# Altium schematic sheet PMIC_USB.SchDoc
size A4; SheetNumber: 2; SheetTotal: 3
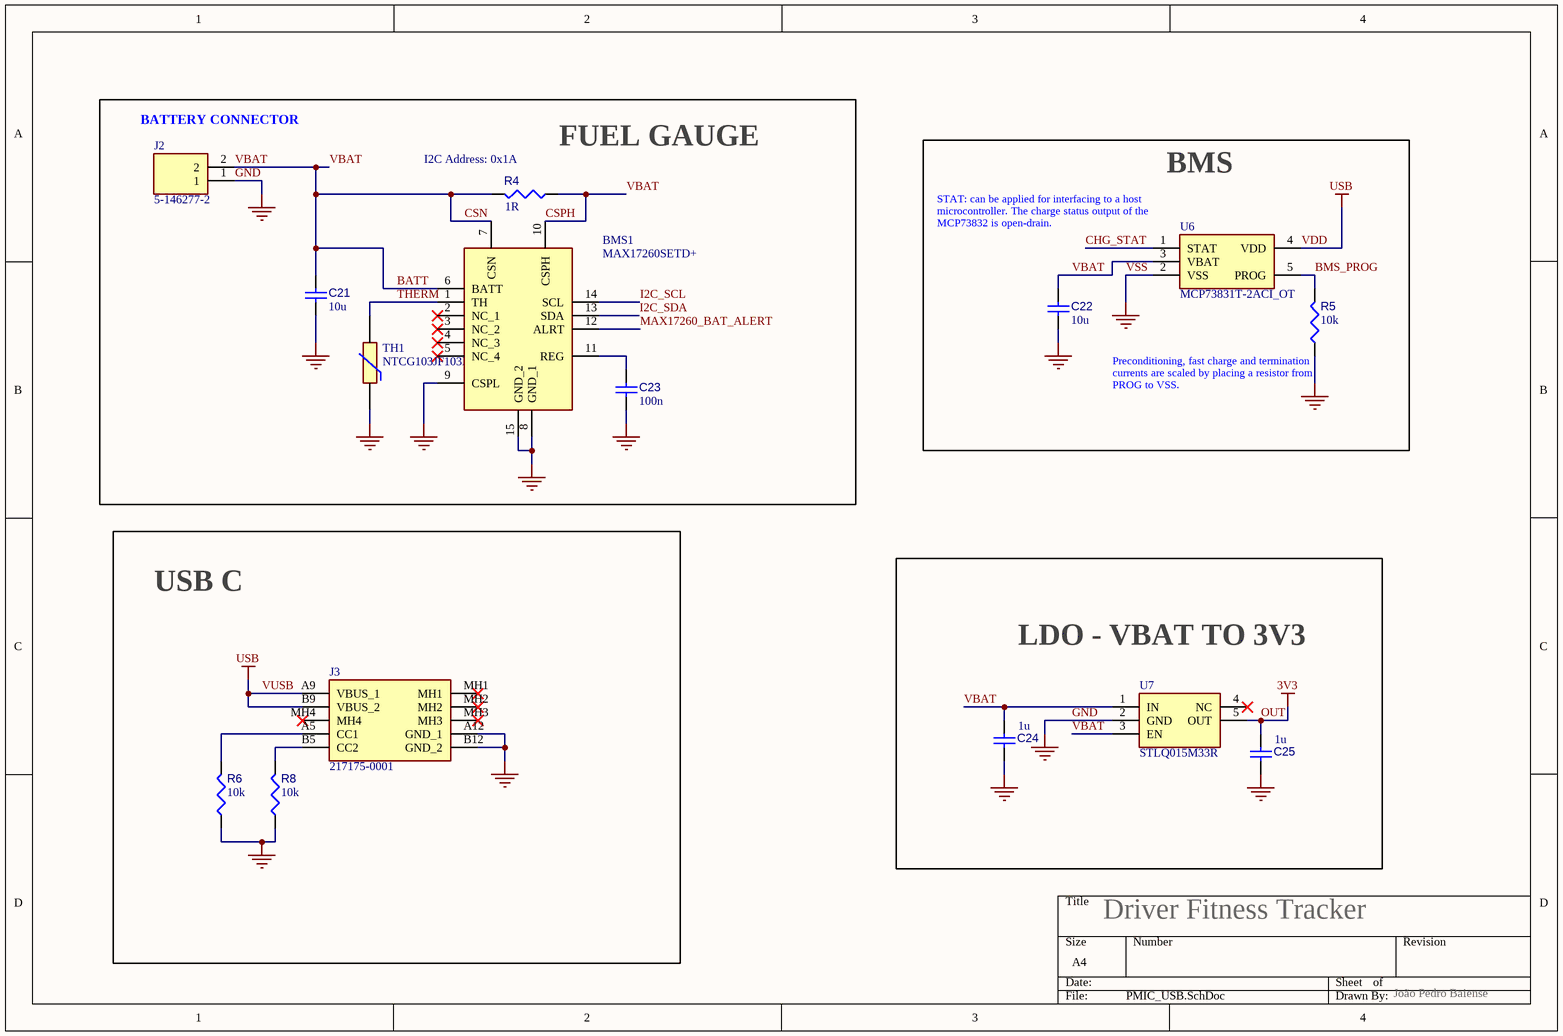
[diagram p0: PMIC_USB.SchDoc]

## Parts
BMS1  MAX17260SETD+  [SON40P300X300X80-15N]
C21  10u  [CAPC1608X90X40NL10T20]
C22  10u  [CAPC1608X90X40NL10T20]
C23  100n  [CAPC1608X90X40NL10T20]
C24  1u  [CAPC1608X90X40NL10T20]
C25  1u  [CAPC1608X90X40NL10T20]
J2  5-146277-2  [HEADER_2PINS]
J3  217175-0001  [USB_C_CONNECTOR]
R4  1R  [RESC0402(1005)_L]
R5  10k  [RESC0402(1005)_L]
R6  10k  [RESC0402(1005)_L]
R8  10k  [RESC0402(1005)_L]
TH1  NTCG103JF103FT1  [THRMC1005X55N]
U6  MCP73831T-2ACI_OT  [SOT95P270X145-5N]
U7  STLQ015M33R  [SOT95P280X145-5N]

## Blocks framed on the sheet
FUEL GAUGE: BMS1 C21 C23 J2 R4 TH1
BMS: C22 R5 U6
USB C: J3 R6 R8
LDO - VBAT TO 3V3: C24 C25 U7

## Nets
GND: BMS1.8(GND_1) BMS1.9(CSPL) BMS1.15(GND_2) C21.2 C22.2 C23.1 C24.2 C25.2 J2.1 J3.A12(GND_1) J3.B12(GND_2) R5.1 R6.1 R8.1 TH1.1 U6.2(VSS) U7.2(GND)  [also labelled VSS]
OUT: C25.1 U7.5(OUT)  [also labelled 3V3]
VDD: J3.A9(VBUS_1) J3.B9(VBUS_2) U6.4(VDD)  [also labelled USB, VUSB]
BATT: BMS1.6(BATT) BMS1.7(CSN) BMS1.10(CSPH) C21.1 C22.1 C24.1 J2.2 R4.1 R4.2 U6.3(VBAT) U7.1(IN) U7.3(EN)  [also labelled CSN, CSPH, VBAT]
BMS_PROG: R5.2 U6.5(PROG)
CHG_STAT: U6.1(STAT)
I2C_SCL: BMS1.14(SCL)
I2C_SDA: BMS1.13(SDA)
MAX17260_BAT_ALERT: BMS1.12(ALRT)
THERM: BMS1.1(TH) TH1.2
NetBMS1_11: BMS1.11(REG) C23.2
NetJ3_A5: J3.A5(CC1) R6.2
NetJ3_B5: J3.B5(CC2) R8.2

Not connected (* = marked no-connect by the designer): BMS1 2(NC_1)* 3(NC_2)* 4(NC_3)* 5(NC_4)*; J3 MH1* MH2* MH3* MH4*; U7 4(NC)*

## Notes on the sheet
- (near J2) BATTERY CONNECTOR
- (near R4) I2C Address: 0x1A
- (near U6) STAT: can be applied for interfacing to a host microcontroller. The charge status output of the MCP73832 is open-drain.
- (near R5) Preconditioning, fast charge and termination currents are scaled by placing a resistor from PROG to VSS.
- Driver Fitness Tracker
- João Pedro Baiense

## Library data of the parts
BMS1 = MAX17260SETD+: Battery Management 5.1 A 1-Cell Fuel Gauge with ModelGauge m5 EZ and Optional High-Side Current Sensing; Manufacturer_Name: Analog Devices; Geometry.Height: 0.8mm; Mouser Part Number: 700-MAX17260SETD+; Mouser Price/Stock: https://www.mouser.co.uk/ProductDetail/Analog-Devices-Maxim-Integrated/MAX17260SETD%2b?qs=%252BEew9%252B0nqrAfepKB1Fe0%252Bw%3D%3D; CorrectManufacturer: MAX17260SETD+; Datasheet Link: https://www.maximintegrated.com/en/ds/MAX17260.pdf; Available at JLCPCB?: Yes; JLCPCB Part #: C350946
C21 C22 = CMP-001-00017-6: Multilayer Ceramic Capacitors MLCC - SMD/SMT NEW GLOBAL PN KGM15CR51C106MT 0603; CorrectManufacturer: 0603YD106MAT2A; Tolerance: 10%; Voltage Rating: 50V; Mounting Technology: SM; Value: 10u; Max Operating Temperature: 125°C; RoHS Compliant: True; Pins: 2; Capacitor Type: Ceramic; Case/Package: 0603; JLCPCB Part #: C19702
C23 = CMP-001-00017-6: Multilayer Ceramic Capacitors MLCC - SMD/SMT 50V 0.1 uF X7R 0603 10% AEC-Q200; CorrectManufacturer: KAM15AR71H104KT; Tolerance: 10%; Voltage Rating: 50V; Mounting Technology: SM; Value: 100n; Max Operating Temperature: 125°C; RoHS Compliant: True; Pins: 2; Capacitor Type: Ceramic; Case/Package: 0603; JLCPCB Part #: C1523
C24 C25 = CMP-001-00017-6: Multilayer Ceramic Capacitors MLCC - SMD/SMT 50V 1uF X7R 0603 10%; CorrectManufacturer: 06035C105KAT2A; Tolerance: 10%; Voltage Rating: 50V; Mounting Technology: SM; Value: 1u; Max Operating Temperature: 125°C; RoHS Compliant: True; Pins: 2; Capacitor Type: Ceramic; Case/Package: 0603; JLCPCB Part #: C15849
J2 = BATT_CONN_1: Headers & Wire Housings 2P HEADER GOLD 30u single row; Manufacturer_Name: TE Connectivity; Geometry.Height: 8.23mm; CorrectManufacturer: 5-146277-2; Mouser Part Number: 571-5-146277-2; Mouser Price/Stock: https://www.mouser.co.uk/ProductDetail/TE-Connectivity/5-146277-2?qs=bwpFY26eRVdSYoepUea0uA%3D%3D; Arrow Part Number: 5-146277-2; Arrow Price/Stock: https://www.arrow.com/en/products/5-146277-2/te-connectivity?region=nac; Datasheet Link: https://www.te.com/commerce/DocumentDelivery/DDEController?Action=srchrtrv&DocNm=146277&DocType=Customer+Drawing&DocLang=English
J3 = USB_C_CONNECTOR: USB Connectors Top-Mnt SMT 6Ckt Type C Rec Molex; Geometry.Height: 3.46mm; Manufacturer_Name: Molex; CorrectManufacturer: 217175-0001; Mouser Part Number: 538-217175-0001; Mouser Price/Stock: https://www.mouser.co.uk/ProductDetail/Molex/217175-0001?qs=DRkmTr78QARWJMiqNnldSg%3D%3D; Arrow Part Number: *; Arrow Price/Stock: *; Datasheet Link: https://www.molex.com/pdm_docs/sd/2171750001_sd.pdf
R4 = CMP-009-00149-3: Thin Film Resistors - SMD .1W 1.0ohm 1% 0402 50ppm; CorrectManufacturer: MCS0402MC1008FE000; Power: 63mW; Min Operating Temperature: -55°C; Tolerance: 1%; Case/Package: 0402; Max Operating Temperature: 155°C; Value: 1R; Pins: 2
R5 R6 R8 = CMP-009-00149-3: Thin Film Resistors - SMD 1/16W 10K ohm 1% 50ppm; CorrectManufacturer: RT0402FRE0710KL; Power: 63mW; Min Operating Temperature: -55°C; Tolerance: 1%; Case/Package: 0402; Max Operating Temperature: 155°C; Value: 10k; Pins: 2; JLCPCB Part #: C25744
TH1 = NTCG103JF103FT1: NTC (Negative Temperature Coefficient) Thermistors THERMISTOR, NTC 10K OHM, 1%, 0402; Manufacturer_Name: TDK; Geometry.Height: 0.55mm; Mouser Part Number: 810-NTCG103JF103FT1; Mouser Price/Stock: https://www.mouser.co.uk/ProductDetail/TDK/NTCG103JF103FT1?qs=f0gCvUGw%252BIwLiM8IfZktlg%3D%3D; CorrectManufacturer: NTCG103JF103FT1; Datasheet Link: https://product.tdk.com/system/files/dam/doc/product/sensor/ntc/chip-ntc-thermistor/catalog/tpd_commercial_ntc-thermistor_ntcg_en.pdf; JLCPCB Link: https://jlcpcb.com/partdetail/Tdk-NTCG103JF103FT1/C209959; Available at JLCPCB?: Yes; JLCPCB Part #: C209959
U6 = MCP73831T-2ACI_OT: Battery Management Charge mgnt contr; Manufacturer_Name: Microchip; CorrectManufacturer: MCP73831T-2ACI/OT; Geometry.Height: 1.45mm; Mouser Part Number: 579-MCP73831T-2ACIOT; Mouser Price/Stock: https://www.mouser.co.uk/ProductDetail/Microchip-Technology/MCP73831T-2ACI-OT?qs=yUQqVecv4qvbBQBGbHx0Mw%3D%3D; Arrow Part Number: MCP73831T-2ACI/OT; Arrow Price/Stock: https://www.arrow.com/en/products/mcp73831t-2aciot/microchip-technology?region=nac; Datasheet Link: http://ww1.microchip.com/downloads/en/DeviceDoc/20001984g.pdf; Available at JLCPCB?: Yes; JLCPCB Part #: C424093
U7 = STLQ015M33R: LDO Voltage Regulators 150 mA - ultra low quiescent current linear voltage regulator; Manufacturer_Name: STMicroelectronics; Geometry.Height: 1.45mm; Mouser Part Number: 511-STLQ015M33R; Mouser Price/Stock: https://www.mouser.co.uk/ProductDetail/STMicroelectronics/STLQ015M33R?qs=k5OWtXsTJaojAOdVSaZ6wQ%3D%3D; CorrectManufacturer: STLQ015M33R; Datasheet Link: https://rs.componentsearchengine.com/Datasheets/2/STLQ015M33R.pdf; JLCPCB Link: https://jlcpcb.com/partdetail/Stmicroelectronics-STLQ015M33R/C136154; JLCPCB Part #: C136154